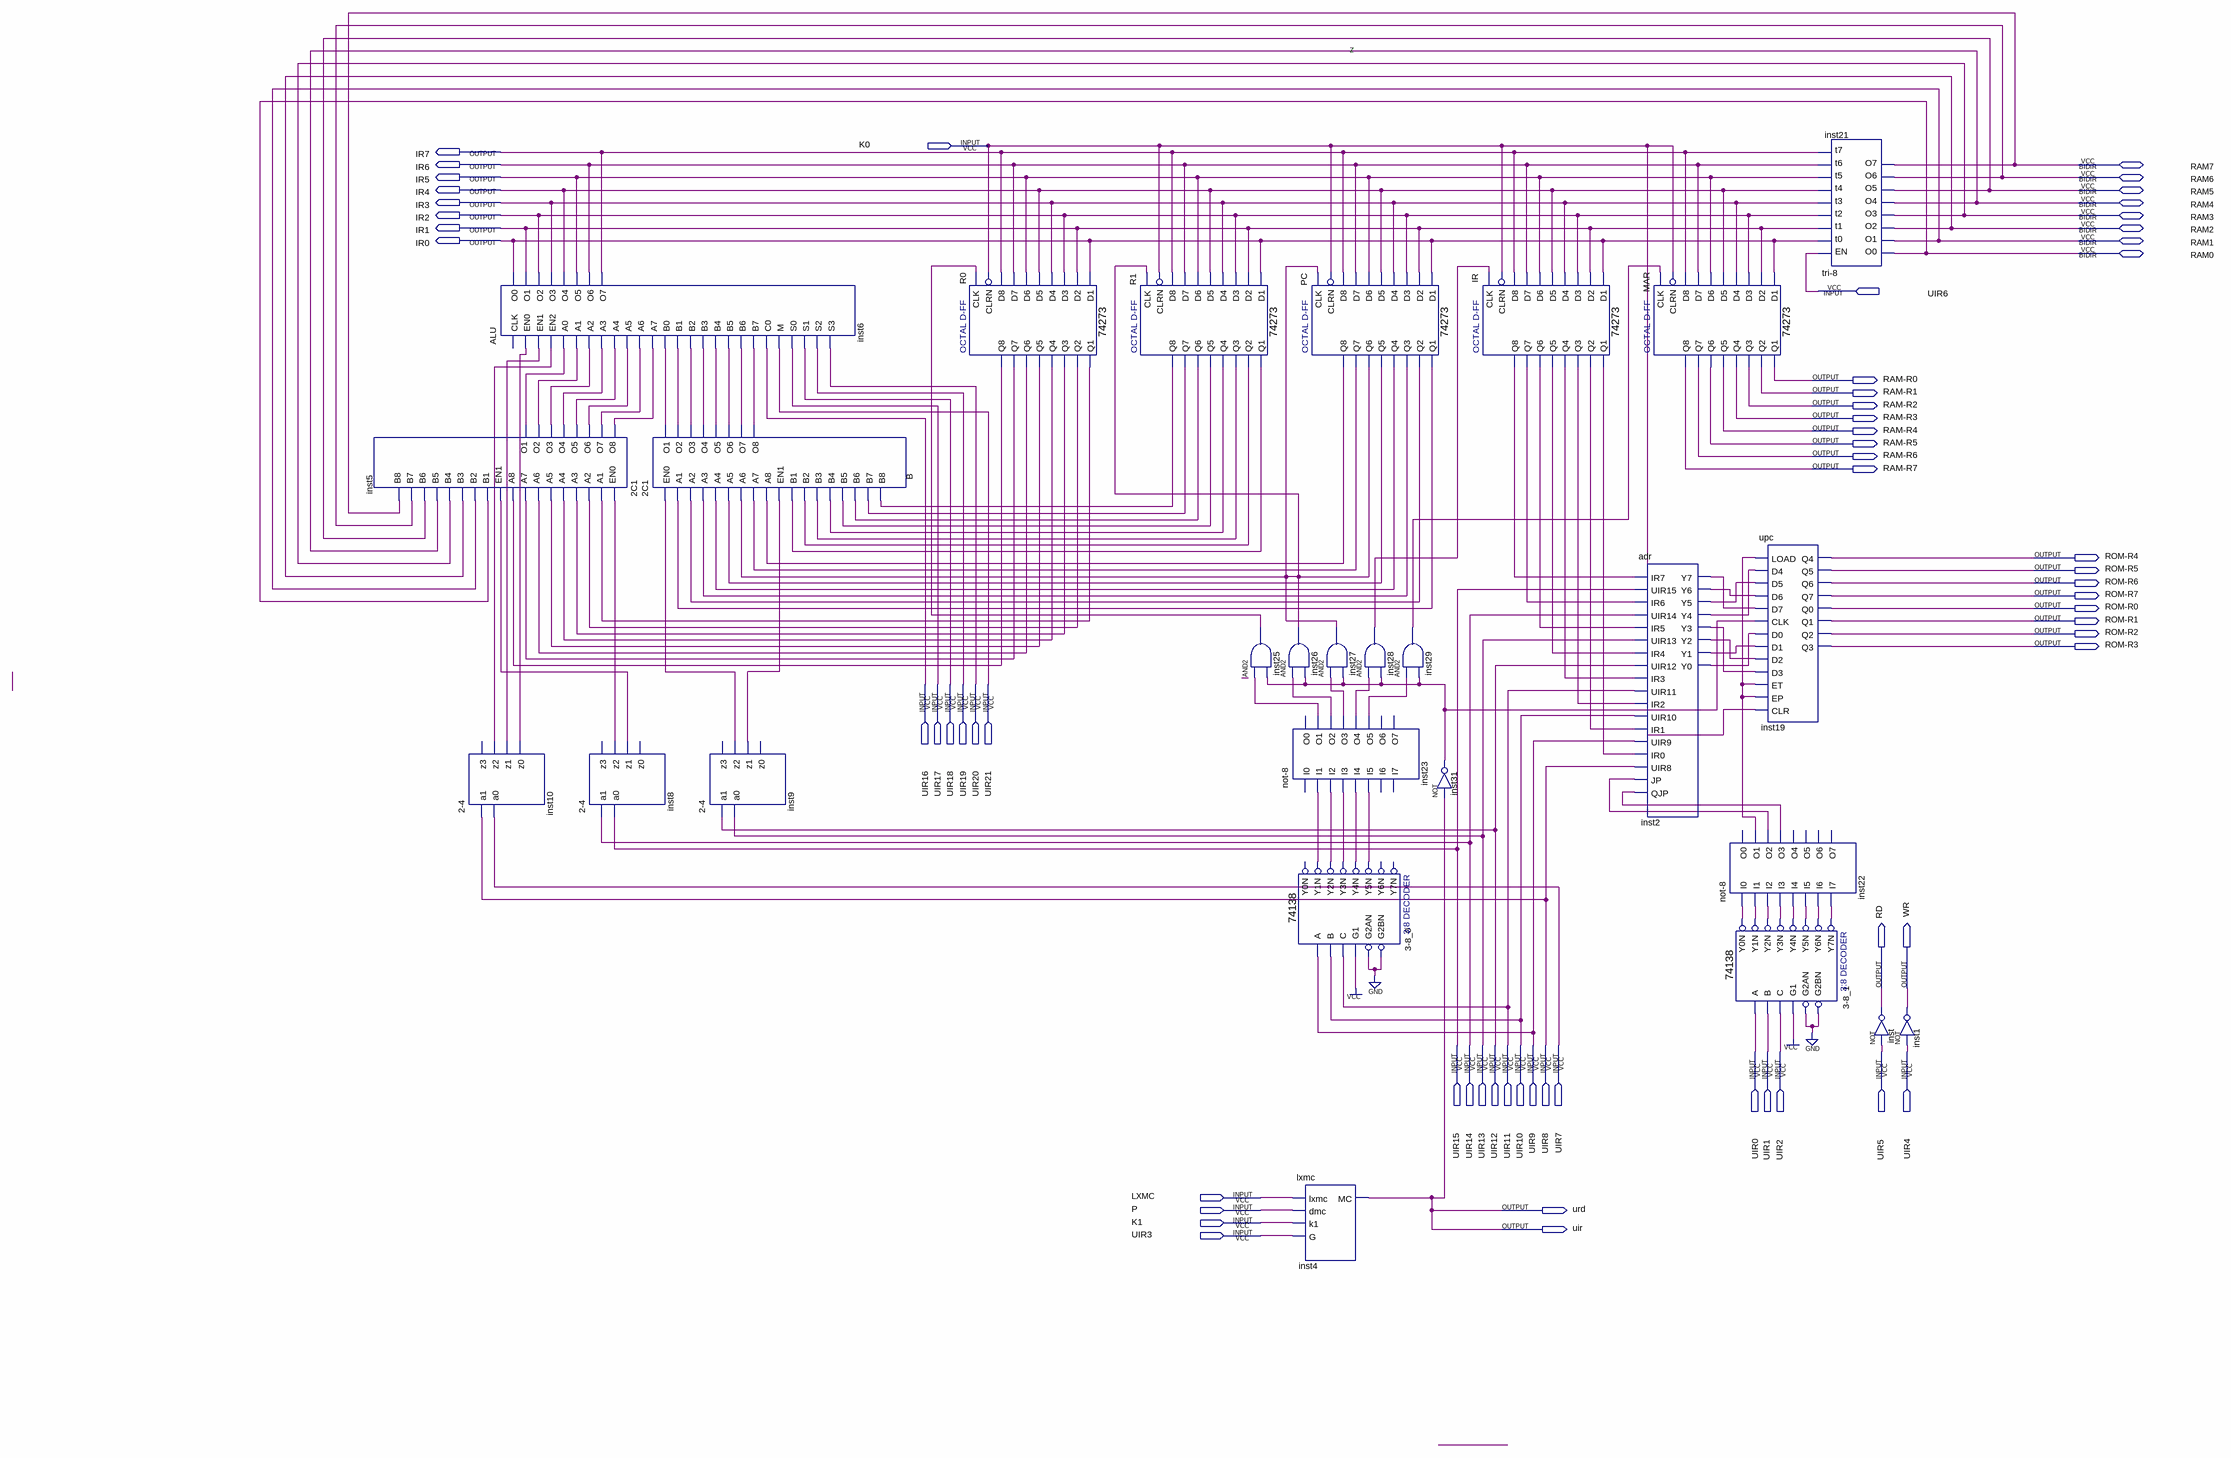
[diagram p0: schematic sheet]
// Quartus schematic 4-1.bdf as structural Verilog: 27 symbols, 62 pins
module \4-1  (
  input  K0,
  input  UIR6,
  input  UIR16,
  input  UIR17,
  input  UIR18,
  input  UIR19,
  input  UIR20,
  input  UIR21,
  input  UIR15,
  input  UIR14,
  input  UIR13,
  input  UIR12,
  input  UIR11,
  input  UIR10,
  input  UIR9,
  input  UIR8,
  input  UIR7,
  input  UIR0,
  input  UIR1,
  input  UIR2,
  input  UIR5,
  input  UIR4,
  input  LXMC,
  input  P,
  input  K1,
  input  UIR3,
  inout  RAM7,
  inout  RAM6,
  inout  RAM5,
  inout  RAM4,
  inout  RAM3,
  inout  RAM2,
  inout  RAM1,
  inout  RAM0,
  output IR7,
  output IR6,
  output IR5,
  output IR4,
  output IR3,
  output IR2,
  output IR1,
  output IR0,
  output \RAM-R0 ,
  output \RAM-R1 ,
  output \RAM-R2 ,
  output \RAM-R3 ,
  output \RAM-R4 ,
  output \RAM-R5 ,
  output \RAM-R6 ,
  output \RAM-R7 ,
  output \ROM-R4 ,
  output \ROM-R5 ,
  output \ROM-R6 ,
  output \ROM-R7 ,
  output \ROM-R0 ,
  output \ROM-R1 ,
  output \ROM-R2 ,
  output \ROM-R3 ,
  output RD,
  output WR,
  output urd,
  output uir
);

  wire B_o1, B_o2, B_o3, B_o4, B_o5, B_o6, B_o7, B_o8, inst2_y0, inst2_y1, inst2_y2, inst2_y3, inst2_y4,
       inst2_y5, inst2_y6, inst2_y7, inst5_o1, inst5_o2, inst5_o3, inst5_o4, inst5_o5, inst5_o6, inst5_o7,
       inst5_o8, inst8_z1, inst8_z2, inst9_z1, inst9_z2, inst10_z0, inst10_z1, inst10_z2, inst22_o1,
       inst22_o2, inst22_o3, inst23_o1, inst23_o2, inst23_o3, inst23_o4, inst23_o5, inst25_out, inst28_out,
       inst29_out, inst31_out, IR_q1, IR_q2, IR_q3, IR_q4, IR_q5, IR_q6, IR_q7, IR_q8, n3_8_0_y1n,
       n3_8_0_y2n, n3_8_0_y3n, n3_8_0_y4n, n3_8_0_y5n, n3_8_1_y0n, n3_8_1_y1n, n3_8_1_y2n, n3_8_1_y3n,
       n3_8_1_y4n, n3_8_1_y5n, n3_8_1_y6n, n3_8_1_y7n, PC_q1, PC_q2, PC_q3, PC_q4, PC_q5, PC_q6, PC_q7,
       PC_q8, R0_q1, R0_q2, R0_q3, R0_q4, R0_q5, R0_q6, R0_q7, R0_q8, R1_q1, R1_q2, R1_q3, R1_q4, R1_q5,
       R1_q6, R1_q7, R1_q8;

  \2C1  inst5 (
    .EN0(inst8_z2), .A1(R0_q1), .A2(R0_q2), .A3(R0_q3), .A4(R0_q4), .A5(R0_q5), .A6(R0_q6), .A7(R0_q7),
    .A8(R0_q8), .EN1(inst8_z1), .B1(RAM0), .B2(RAM1), .B3(RAM2), .B4(RAM3), .B5(RAM4), .B6(RAM5), .B7(RAM6),
    .B8(RAM7), .O8(inst5_o8), .O7(inst5_o7), .O6(inst5_o6), .O5(inst5_o5), .O4(inst5_o4), .O3(inst5_o3),
    .O2(inst5_o2), .O1(inst5_o1));
  \2-4  inst10 (.a1(UIR8), .a0(UIR7), .z2(inst10_z2), .z1(inst10_z1), .z0(inst10_z0));  // open: z3
  ALU inst6 (
    .EN0(inst10_z0), .EN1(inst10_z1), .EN2(inst10_z2), .A0(inst5_o1), .A1(inst5_o2), .A2(inst5_o3),
    .A3(inst5_o4), .A4(inst5_o5), .A5(inst5_o6), .A6(inst5_o7), .A7(inst5_o8), .B0(B_o1), .B1(B_o2),
    .B2(B_o3), .B3(B_o4), .B4(B_o5), .B5(B_o6), .B6(B_o7), .B7(B_o8), .C0(UIR16), .M(UIR21), .S0(UIR17),
    .S1(UIR18), .S2(UIR19), .S3(UIR20), .O0(IR0), .O1(IR1), .O2(IR2), .O3(IR3), .O4(IR4), .O5(IR5), .O6(IR6),
    .O7(IR7));  // open: CLK
  \2-4  inst8 (.a1(UIR14), .a0(UIR15), .z2(inst8_z2), .z1(inst8_z1));  // open: z3, z0
  \2C1  B (
    .EN0(inst9_z2), .A1(PC_q1), .A2(PC_q2), .A3(PC_q3), .A4(PC_q4), .A5(PC_q5), .A6(PC_q6), .A7(PC_q7),
    .A8(PC_q8), .EN1(inst9_z1), .B1(R1_q1), .B2(R1_q2), .B3(R1_q3), .B4(R1_q4), .B5(R1_q5), .B6(R1_q6),
    .B7(R1_q7), .B8(R1_q8), .O1(B_o1), .O2(B_o2), .O3(B_o3), .O4(B_o4), .O5(B_o5), .O6(B_o6), .O7(B_o7),
    .O8(B_o8));
  \2-4  inst9 (.a1(UIR12), .a0(UIR13), .z2(inst9_z2), .z1(inst9_z1));  // open: z3, z0
  \74273  R0 (
    .D2(IR1), .D3(IR2), .D1(IR0), .D4(IR3), .D7(IR6), .D6(IR5), .D5(IR4), .D8(IR7), .CLK(inst25_out),
    .CLRN(K0), .Q4(R0_q4), .Q1(R0_q1), .Q2(R0_q2), .Q3(R0_q3), .Q6(R0_q6), .Q5(R0_q5), .Q7(R0_q7), .Q8(R0_q8));
  \74273  R1 (
    .D2(IR1), .D3(IR2), .D1(IR0), .D4(IR3), .D7(IR6), .D6(IR5), .D5(IR4), .D8(IR7), .CLK(PC_q6), .CLRN(K0),
    .Q4(R1_q4), .Q1(R1_q1), .Q2(R1_q2), .Q3(R1_q3), .Q6(R1_q6), .Q5(R1_q5), .Q7(R1_q7), .Q8(R1_q8));
  and inst25 (inst25_out, inst23_o1, inst31_out);
  \74273  PC (
    .D2(IR1), .D3(IR2), .D1(IR0), .D4(IR3), .D7(IR6), .D6(IR5), .D5(IR4), .D8(IR7), .CLK(PC_q6), .CLRN(K0),
    .Q4(PC_q4), .Q1(PC_q1), .Q2(PC_q2), .Q3(PC_q3), .Q6(PC_q6), .Q5(PC_q5), .Q7(PC_q7), .Q8(PC_q8));
  and inst26 (PC_q6, inst23_o2, inst31_out);
  and inst27 (PC_q6, inst23_o3, inst31_out);
  \not-8  inst23 (
    .I1(n3_8_0_y1n), .I2(n3_8_0_y2n), .I3(n3_8_0_y3n), .I4(n3_8_0_y4n), .I5(n3_8_0_y5n), .O1(inst23_o1),
    .O2(inst23_o2), .O3(inst23_o3), .O4(inst23_o4), .O5(inst23_o5));  // open: I0, I6, I7, O0, O6, O7
  \74138  \u_3-8_0  (
    .A(UIR9), .B(UIR10), .G1(1'b1), .C(UIR11), .G2AN(1'b0), .G2BN(1'b0), .Y1N(n3_8_0_y1n), .Y2N(n3_8_0_y2n),
    .Y3N(n3_8_0_y3n), .Y4N(n3_8_0_y4n), .Y5N(n3_8_0_y5n));  // open: Y0N, Y6N, Y7N
  lxmc inst4 (.lxmc(LXMC), .dmc(P), .k1(K1), .G(UIR3), .MC(uir));
  and inst28 (inst28_out, inst23_o4, inst31_out);
  and inst29 (inst29_out, inst23_o5, inst31_out);
  \74273  IR (
    .D2(IR1), .D3(IR2), .D1(IR0), .D4(IR3), .D7(IR6), .D6(IR5), .D5(IR4), .D8(IR7), .CLK(inst28_out),
    .CLRN(K0), .Q4(IR_q4), .Q1(IR_q1), .Q2(IR_q2), .Q3(IR_q3), .Q6(IR_q6), .Q5(IR_q5), .Q7(IR_q7), .Q8(IR_q8));
  not inst31 (inst31_out, uir);
  \74273  MAR (
    .D2(IR1), .D3(IR2), .D1(IR0), .D4(IR3), .D7(IR6), .D6(IR5), .D5(IR4), .D8(IR7), .CLK(inst29_out),
    .CLRN(K0), .Q4(\RAM-R3 ), .Q1(\RAM-R0 ), .Q2(\RAM-R1 ), .Q3(\RAM-R2 ), .Q6(\RAM-R5 ), .Q5(\RAM-R4 ),
    .Q7(\RAM-R6 ), .Q8(\RAM-R7 ));
  adr inst2 (
    .IR7(IR_q8), .UIR15(UIR15), .IR6(IR_q7), .UIR14(UIR14), .IR5(IR_q6), .UIR13(UIR13), .IR4(IR_q5),
    .UIR12(UIR12), .IR3(IR_q4), .UIR11(UIR11), .IR2(IR_q3), .UIR10(UIR10), .IR1(IR_q2), .UIR9(UIR9),
    .IR0(IR_q1), .UIR8(UIR8), .JP(inst22_o2), .QJP(inst22_o3), .Y7(inst2_y7), .Y6(inst2_y6), .Y5(inst2_y5),
    .Y4(inst2_y4), .Y3(inst2_y3), .Y2(inst2_y2), .Y1(inst2_y1), .Y0(inst2_y0));
  \not-8  inst22 (
    .I0(n3_8_1_y0n), .I1(n3_8_1_y1n), .I2(n3_8_1_y2n), .I3(n3_8_1_y3n), .I4(n3_8_1_y4n), .I5(n3_8_1_y5n),
    .I6(n3_8_1_y6n), .I7(n3_8_1_y7n), .O1(inst22_o1), .O2(inst22_o2), .O3(inst22_o3));  // open: O0, O4, O5, O6, O7
  \74138  \u_3-8_1  (
    .A(UIR0), .B(UIR1), .G1(1'b1), .C(UIR2), .G2AN(1'b0), .G2BN(1'b0), .Y0N(n3_8_1_y0n), .Y1N(n3_8_1_y1n),
    .Y2N(n3_8_1_y2n), .Y3N(n3_8_1_y3n), .Y4N(n3_8_1_y4n), .Y5N(n3_8_1_y5n), .Y6N(n3_8_1_y6n), .Y7N(n3_8_1_y7n));
  upc inst19 (
    .LOAD(inst22_o1), .D4(inst2_y4), .D5(inst2_y5), .D6(inst2_y6), .D7(inst2_y7), .CLK(inst31_out),
    .D0(inst2_y0), .D1(inst2_y1), .D2(inst2_y2), .D3(inst2_y3), .ET(inst22_o1), .EP(inst22_o1), .CLR(K0),
    .Q4(\ROM-R4 ), .Q5(\ROM-R5 ), .Q6(\ROM-R6 ), .Q7(\ROM-R7 ), .Q0(\ROM-R0 ), .Q1(\ROM-R1 ), .Q2(\ROM-R2 ),
    .Q3(\ROM-R3 ));
  \tri-8  inst21 (
    .EN(UIR6), .t0(IR0), .t1(IR1), .t2(IR2), .t3(IR3), .t4(IR4), .t5(IR5), .t6(IR6), .t7(IR7), .O0(RAM0),
    .O1(RAM1), .O2(RAM2), .O3(RAM3), .O4(RAM4), .O5(RAM5), .O6(RAM6), .O7(RAM7));
  not inst (RD, UIR5);
  not inst1 (WR, UIR4);

  assign urd = uir;

  // Notes on the sheet:
  //   z
endmodule
